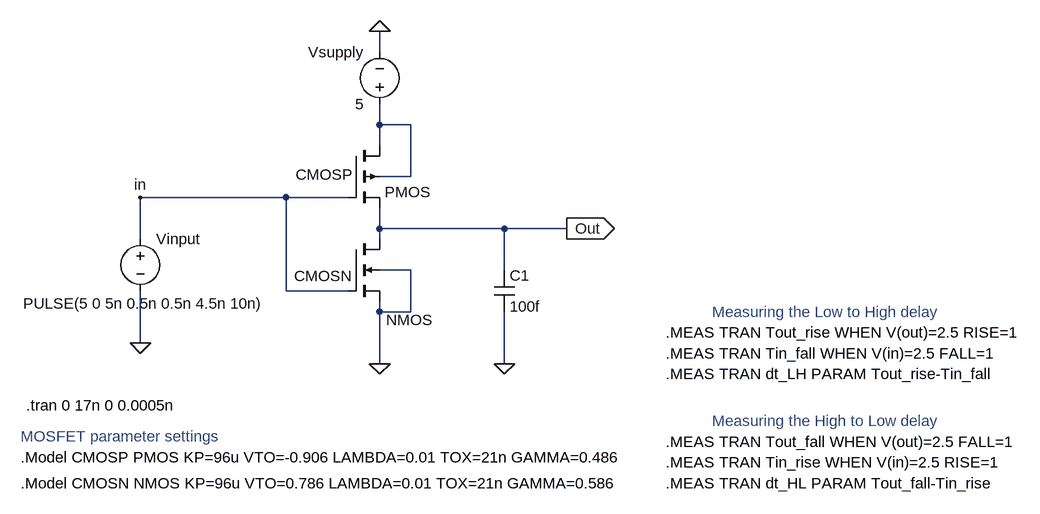
[diagram p0: schematic Inverter.asc]
Inverter.asc, the LTspice schematic file:
Version 4
SHEET 1 1984 752
WIRE 384 -80 384 -112
WIRE 384 32 384 0
WIRE 432 32 384 32
WIRE 384 64 384 32
WIRE 432 112 432 32
WIRE 432 112 384 112
WIRE 240 144 16 144
WIRE 336 144 240 144
WIRE 384 192 384 160
WIRE 576 192 384 192
WIRE 672 192 576 192
WIRE 16 208 16 144
WIRE 384 208 384 192
WIRE 432 256 384 256
WIRE 576 256 576 192
WIRE 240 288 240 144
WIRE 336 288 240 288
WIRE 384 320 384 304
WIRE 432 320 432 256
WIRE 432 320 384 320
WIRE 16 368 16 288
WIRE 384 400 384 320
WIRE 576 400 576 320
FLAG 384 400 0
FLAG 384 -112 0
FLAG 16 368 0
FLAG 672 192 Out
IOPIN 672 192 Out
FLAG 576 400 0
FLAG 16 144 in
SYMBOL pmos4 336 64 R0
WINDOW 0 -81 45 Left 2
SYMATTR InstName CMOSP
SYMATTR Value2 l=10u w=200u
SYMBOL nmos4 336 208 R0
WINDOW 0 -83 57 Left 2
WINDOW 3 58 125 Left 2
SYMATTR InstName CMOSN
SYMATTR Value2 l=10u w=100u
SYMBOL voltage 384 16 R180
WINDOW 0 24 96 Left 2
WINDOW 3 24 16 Left 2
WINDOW 123 0 0 Left 0
WINDOW 39 0 0 Left 0
SYMATTR InstName Vsupply
SYMATTR Value 5
SYMBOL voltage 16 192 R0
WINDOW 3 -180 115 Left 2
WINDOW 123 0 0 Left 0
WINDOW 39 0 0 Left 0
SYMATTR Value PULSE(5 0 5n 0.5n 0.5n 4.5n 10n)
SYMATTR InstName Vinput
SYMBOL cap 560 256 R0
SYMATTR InstName C1
SYMATTR Value 100f
TEXT -160 464 Left 2 !.tran 0 17n 0 0.0005n
TEXT -168 584 Left 2 !.Model CMOSN NMOS KP=96u VTO=0.786 LAMBDA=0.01 TOX=21n GAMMA=0.586
TEXT -168 544 Left 2 !.Model CMOSP PMOS KP=96u VTO=-0.906 LAMBDA=0.01 TOX=21n GAMMA=0.486
TEXT 824 352 Left 2 !.MEAS TRAN Tout_rise WHEN V(out)=2.5 RISE=1
TEXT 824 384 Left 2 !.MEAS TRAN Tin_fall WHEN V(in)=2.5 FALL=1
TEXT 824 416 Left 2 !.MEAS TRAN dt_LH PARAM Tout_rise-Tin_fall
TEXT 824 520 Left 2 !.MEAS TRAN Tout_fall WHEN V(out)=2.5 FALL=1
TEXT 824 552 Left 2 !.MEAS TRAN Tin_rise WHEN V(in)=2.5 RISE=1
TEXT 824 584 Left 2 !.MEAS TRAN dt_HL PARAM Tout_fall-Tin_rise
TEXT 896 320 Left 2 ;Measuring the Low to High delay
TEXT 896 488 Left 2 ;Measuring the High to Low delay
TEXT -168 512 Left 2 ;MOSFET parameter settings

The netlist it stands for:
* Inverter.asc
M§CMOSP N001 in Out N001 PMOS l=10u w=200u
M§CMOSN Out in 0 0 NMOS l=10u w=100u
Vsupply N001 0 5
Vinput in 0 PULSE(5 0 5n 0.5n 0.5n 4.5n 10n)
C1 Out 0 100f
.model NMOS NMOS
.model PMOS PMOS
.lib standard.mos
.tran 0 17n 0 0.0005n
.Model CMOSN NMOS KP=96u VTO=0.786 LAMBDA=0.01 TOX=21n GAMMA=0.586
.Model CMOSP PMOS KP=96u VTO=-0.906 LAMBDA=0.01 TOX=21n GAMMA=0.486
.MEAS TRAN Tout_rise WHEN V(out)=2.5 RISE=1
.MEAS TRAN Tin_fall WHEN V(in)=2.5 FALL=1
.MEAS TRAN dt_LH PARAM Tout_rise-Tin_fall
.MEAS TRAN Tout_fall WHEN V(out)=2.5 FALL=1
.MEAS TRAN Tin_rise WHEN V(in)=2.5 RISE=1
.MEAS TRAN dt_HL PARAM Tout_fall-Tin_rise
* Measuring the Low to High delay
* Measuring the High to Low delay
* MOSFET parameter settings
.backanno
.end

* Results of the author's LTspice run, read from the files saved beside the schematic
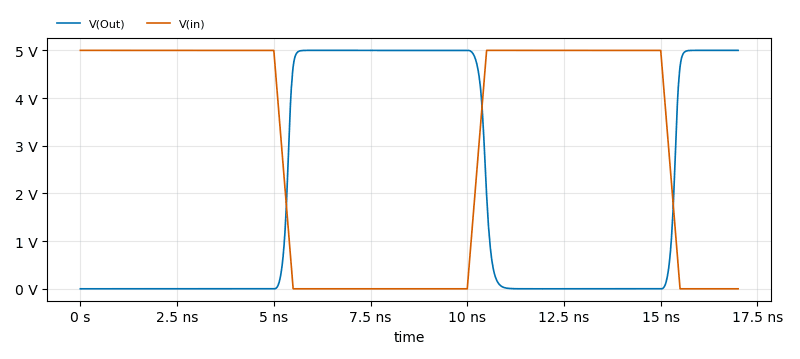
[diagram p1: Transient Analysis of Inverter.asc, plotted from the saved traces]
* Transient Analysis, 1 run:
*   V(Out): min 0 V, max 5 V, average 1.989 V, rms 3.108 V, last 5 V
*   V(in): min 0 V, max 5 V, average 3.015 V, rms 3.835 V, last 0 V
* From the log:
*   tout_rise: v(out)=2.5 AT 5.36176e-09
*   tin_fall: v(in)=2.5 AT 5.25e-09
*   dt_lh: tout_rise-tin_fall=1.11764e-10
*   tout_fall: v(out)=2.5 AT 1.0468e-08
*   tin_rise: v(in)=2.5 AT 1.025e-08
*   dt_hl: tout_fall-tin_rise=2.17968e-10